# Altium schematic sheet Encoder.SchDoc
size A4
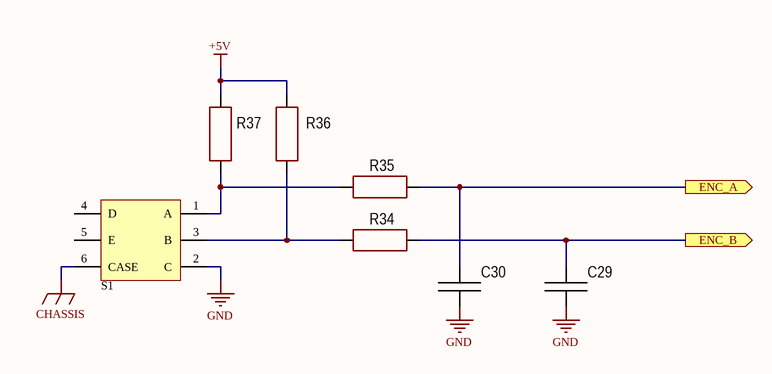
[diagram p0: Encoder.SchDoc]

## Parts
C29  (no value)  [CAP: 1206]
C30  (no value)  [CAP: 1206]
R34  (no value)  [RES: 1206]
R35  (no value)  [RES: 1206]
R36  (no value)  [RES: 1206]
R37  (no value)  [RES: 1206]
S1  (no value)  [PEC11L]

## Ports
ENC_A (out), ENC_B (out)

## Nets
+5V: R36.2 R37.2
CHASSIS: S1.6(CASE)
GND: C29.1 C30.1 S1.2(C)
ENC_A: C30.2 R35.1 ; port ENC_A
ENC_B: C29.2 R34.2 ; port ENC_B
NetR34_1: R34.1 R36.1 S1.3(B)
NetR35_2: R35.2 R37.1 S1.1(A)

Not connected (* = marked no-connect by the designer): S1 4(D) 5(E)

## Library data of the parts
C29 C30 = Ceramic_1206: Manufacturer: Yageo; PartNumber: CC1206KRX7R9BB104; ValueManufacturerPartNumber: Ceramic capacitor, 10nF, 1206; TypeCapacitor: Ceramic capacitor; Tolerance: ±10%; TypeDielectric: X7R; Voltage: 50V; Value: 10nF; Package: 1206; HelpURL: https://www.digikey.com/product-detail/en/yageo/CC1206KRX7R9BB104/311-1179-1-ND/303089; Temperature: -55...+125°C
R34 R35 = Resistor_1206: Manufacturer: Yageo; PartNumber: RC1206JR-07100RL; ValueManufacturerPartNumber: Resistor, 10K, 1206; Power: 0.25W; Tolerance: ±5%; Value: 10K; Package: 1206; HelpURL: https://www.digikey.com/product-detail/en/yageo/RC1206JR-07100RL/311-100ERCT-ND/732153; Temperature: -55...+125°C; TypeResistor: Resistor
R36 R37 = Resistor_1206: Manufacturer: Yageo; PartNumber: RC1206JR-07100RL; ValueManufacturerPartNumber: Resistor, 1K, 1206; Power: 0.25W; Tolerance: ±5%; Value: 1K; Package: 1206; HelpURL: https://www.digikey.com/product-detail/en/yageo/RC1206JR-07100RL/311-100ERCT-ND/732153; Temperature: -55...+125°C; TypeResistor: Resistor
S1 = PEC11L: ValueManufacturerPartNumber: PEC11L; PartNumber: PEC11L